# Altium schematic sheet 03_MCU.SchDoc
size A4
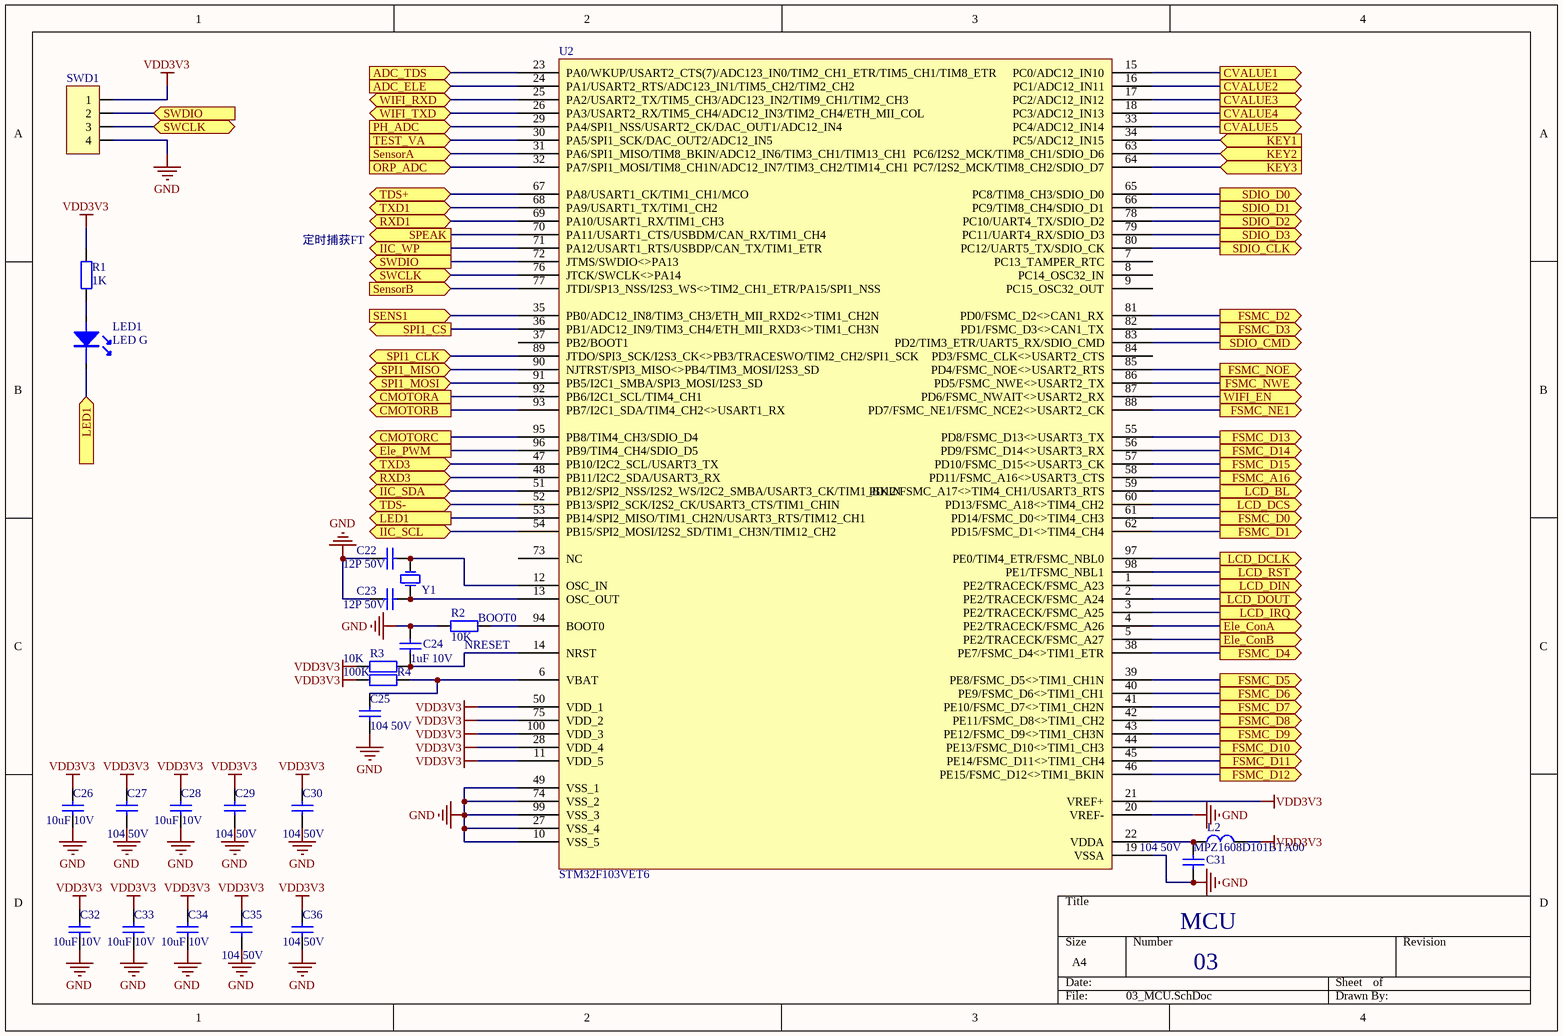
[diagram p0: 03_MCU.SchDoc]

## Parts
C22  12P 50V  [SMD-0603C]
C23  12P 50V  [SMD-0603C]
C24  1uF 10V  [SMD-0603C]
C25  104 50V  [SMD-0603C]
C26  10uF 10V  [SMD-0603C]
C27  104 50V  [SMD-0603C]
C28  10uF 10V  [SMD-0603C]
C29  104 50V  [SMD-0603C]
C30  104 50V  [SMD-0603C]
C31  104 50V  [SMD-0603C]
C32  10uF 10V  [SMD-0603C]
C33  10uF 10V  [SMD-0603C]
C34  10uF 10V  [SMD-0603C]
C35  104 50V  [SMD-0603C]
C36  104 50V  [SMD-0603C]
L2  MPZ1608D101BTA00  [SMD-0603]
LED1  LED G  [SMD-0603D]
R1  1K  [SMD-0603]
R2  10K  [SMD-0603]
R3  10K  [SMD-0603]
R4  100K  [SMD-0603]
SWD1  SIP-4 (NC)  [SIP-4]  (value not drawn)
U2  STM32F103VET6  [LQFP-100_14X14X05P]
Y1  8MHz  [XTAL-3225-2]  (value not drawn)

## Ports
ADC_ELE (in), ADC_TDS (in), CMOTORA (out), CMOTORB (out), CMOTORC (out), CVALUE1 (out), CVALUE2 (out), CVALUE3 (out), CVALUE4 (out), CVALUE5 (out), Ele_ConA (out), Ele_ConB (out), Ele_PWM (out), FSMC_A16 (out), FSMC_D0 (out), FSMC_D1 (out), FSMC_D2 (out), FSMC_D3 (out), FSMC_D4 (out), FSMC_D5 (out), FSMC_D6 (out), FSMC_D7 (out), FSMC_D8 (out), FSMC_D9 (out), FSMC_D10 (out), FSMC_D11 (out), FSMC_D12 (out), FSMC_D13 (out), FSMC_D14 (out), FSMC_D15 (out), FSMC_NE1 (out), FSMC_NOE (out), FSMC_NWE (out), IIC_SCL (bidir), IIC_SDA (bidir), IIC_WP (out), KEY1 (in), KEY2 (in), KEY3 (in), LCD_BL (out), LCD_DCLK (out), LCD_DCS (out), LCD_DIN (out), LCD_DOUT (out), LCD_IRQ (out), LCD_RST (out), LED1 (in), LED1 (out), ORP_ADC (in), PH_ADC (in), RXD1 (bidir), RXD3 (bidir), SDIO_CLK (out), SDIO_CMD (out), SDIO_D0 (out), SDIO_D1 (out), SDIO_D2 (out), SDIO_D3 (out), SENS1 (in), SensorA (in), SensorB (in), SPEAK (out), SPI1_CLK (bidir), SPI1_CS (out), SPI1_MISO (bidir), SPI1_MOSI (bidir), SWCLK, SWCLK (bidir), SWDIO (in), SWDIO (out), TDS+ (bidir), TDS- (bidir), TEST_VA (in), TXD1 (bidir), TXD3 (bidir), WIFI_EN (out), WIFI_RXD (bidir), WIFI_TXD (bidir)

## Nets
GND: C22.2 C23.2 C24.1 C25.1 C26.1 C27.1 C28.1 C29.1 C30.1 C31.1 C32.1 C33.1 C34.1 C35.1 C36.1 R2.2 SWD1.4 U2.10(VSS_5) U2.19(VSSA) U2.20(VREF-) U2.27(VSS_4) U2.49(VSS_1) U2.74(VSS_2) U2.99(VSS_3)
VDD3V3: C26.2 C27.2 C28.2 C29.2 C30.2 C32.2 C33.2 C34.2 C35.2 C36.2 L2.1 R1.2 R3.2 R4.2 SWD1.1 U2.11(VDD_5) U2.21(VREF+) U2.28(VDD_4) U2.50(VDD_1) U2.75(VDD_2) U2.100(VDD_3)
ADC_ELE: U2.24(PA1/USART2_RTS/ADC123_IN1/TIM5_CH2/TIM2_CH2) ; port ADC_ELE
ADC_TDS: U2.23(PA0/WKUP/USART2_CTS(7)/ADC123_IN0/TIM2_CH1_ETR/TIM5_CH1/TIM8_ETR) ; port ADC_TDS
CMOTORA: U2.92(PB6/I2C1_SCL/TIM4_CH1) ; port CMOTORA
CMOTORB: U2.93(PB7/I2C1_SDA/TIM4_CH2<>USART1_RX) ; port CMOTORB
CMOTORC: U2.95(PB8/TIM4_CH3/SDIO_D4) ; port CMOTORC
CVALUE1: U2.15(PC0/ADC12_IN10) ; port CVALUE1
CVALUE2: U2.16(PC1/ADC12_IN11) ; port CVALUE2
CVALUE3: U2.17(PC2/ADC12_IN12) ; port CVALUE3
CVALUE4: U2.18(PC3/ADC12_IN13) ; port CVALUE4
CVALUE5: U2.33(PC4/ADC12_IN14) ; port CVALUE5
Ele_ConA: U2.4(PE2/TRACECK/FSMC_A26) ; port Ele_ConA
Ele_ConB: U2.5(PE2/TRACECK/FSMC_A27) ; port Ele_ConB
Ele_PWM: U2.96(PB9/TIM4_CH4/SDIO_D5) ; port Ele_PWM
FSMC_A16: U2.58(PD11/FSMC_A16<>USART3_CTS) ; port FSMC_A16
FSMC_D0: U2.61(PD14/FSMC_D0<>TIM4_CH3) ; port FSMC_D0
FSMC_D1: U2.62(PD15/FSMC_D1<>TIM4_CH4) ; port FSMC_D1
FSMC_D2: U2.81(PD0/FSMC_D2<>CAN1_RX) ; port FSMC_D2
FSMC_D3: U2.82(PD1/FSMC_D3<>CAN1_TX) ; port FSMC_D3
FSMC_D4: U2.38(PE7/FSMC_D4<>TIM1_ETR) ; port FSMC_D4
FSMC_D5: U2.39(PE8/FSMC_D5<>TIM1_CH1N) ; port FSMC_D5
FSMC_D6: U2.40(PE9/FSMC_D6<>TIM1_CH1) ; port FSMC_D6
FSMC_D7: U2.41(PE10/FSMC_D7<>TIM1_CH2N) ; port FSMC_D7
FSMC_D8: U2.42(PE11/FSMC_D8<>TIM1_CH2) ; port FSMC_D8
FSMC_D9: U2.43(PE12/FSMC_D9<>TIM1_CH3N) ; port FSMC_D9
FSMC_D10: U2.44(PE13/FSMC_D10<>TIM1_CH3) ; port FSMC_D10
FSMC_D11: U2.45(PE14/FSMC_D11<>TIM1_CH4) ; port FSMC_D11
FSMC_D12: U2.46(PE15/FSMC_D12<>TIM1_BKIN) ; port FSMC_D12
FSMC_D13: U2.55(PD8/FSMC_D13<>USART3_TX) ; port FSMC_D13
FSMC_D14: U2.56(PD9/FSMC_D14<>USART3_RX) ; port FSMC_D14
FSMC_D15: U2.57(PD10/FSMC_D15<>USART3_CK) ; port FSMC_D15
FSMC_NE1: U2.88(PD7/FSMC_NE1/FSMC_NCE2<>USART2_CK) ; port FSMC_NE1
FSMC_NOE: U2.85(PD4/FSMC_NOE<>USART2_RTS) ; port FSMC_NOE
FSMC_NWE: U2.86(PD5/FSMC_NWE<>USART2_TX) ; port FSMC_NWE
IIC_SCL: U2.54(PB15/SPI2_MOSI/I2S2_SD/TIM1_CH3N/TIM12_CH2) ; port IIC_SCL
IIC_SDA: U2.51(PB12/SPI2_NSS/I2S2_WS/I2C2_SMBA/USART3_CK/TIM1_BKIN) ; port IIC_SDA
IIC_WP: U2.71(PA12/USART1_RTS/USBDP/CAN_TX/TIM1_ETR) ; port IIC_WP
KEY1: U2.34(PC5/ADC12_IN15) ; port KEY1
KEY2: U2.63(PC6/I2S2_MCK/TIM8_CH1/SDIO_D6) ; port KEY2
KEY3: U2.64(PC7/I2S2_MCK/TIM8_CH2/SDIO_D7) ; port KEY3
LCD_BL: U2.59(PD12/FSMC_A17<>TIM4_CH1/USART3_RTS) ; port LCD_BL
LCD_DCLK: U2.97(PE0/TIM4_ETR/FSMC_NBL0) ; port LCD_DCLK
LCD_DCS: U2.60(PD13/FSMC_A18<>TIM4_CH2) ; port LCD_DCS
LCD_DIN: U2.1(PE2/TRACECK/FSMC_A23) ; port LCD_DIN
LCD_DOUT: U2.2(PE2/TRACECK/FSMC_A24) ; port LCD_DOUT
LCD_IRQ: U2.3(PE2/TRACECK/FSMC_A25) ; port LCD_IRQ
LCD_RST: U2.98(PE1/TFSMC_NBL1) ; port LCD_RST
LED1: LED1.2(K) U2.53(PB14/SPI2_MISO/TIM1_CH2N/USART3_RTS/TIM12_CH1) ; port LED1
ORP_ADC: U2.32(PA7/SPI1_MOSI/TIM8_CH1N/ADC12_IN7/TIM3_CH2/TIM14_CH1) ; port ORP_ADC
PH_ADC: U2.29(PA4/SPI1_NSS/USART2_CK/DAC_OUT1/ADC12_IN4) ; port PH_ADC
RXD1: U2.69(PA10/USART1_RX/TIM1_CH3) ; port RXD1
RXD3: U2.48(PB11/I2C2_SDA/USART3_RX) ; port RXD3
SDIO_CLK: U2.80(PC12/UART5_TX/SDIO_CK) ; port SDIO_CLK
SDIO_CMD: U2.83(PD2/TIM3_ETR/UART5_RX/SDIO_CMD) ; port SDIO_CMD
SDIO_D0: U2.65(PC8/TIM8_CH3/SDIO_D0) ; port SDIO_D0
SDIO_D1: U2.66(PC9/TIM8_CH4/SDIO_D1) ; port SDIO_D1
SDIO_D2: U2.78(PC10/UART4_TX/SDIO_D2) ; port SDIO_D2
SDIO_D3: U2.79(PC11/UART4_RX/SDIO_D3) ; port SDIO_D3
SENS1: U2.35(PB0/ADC12_IN8/TIM3_CH3/ETH_MII_RXD2<>TIM1_CH2N) ; port SENS1
SensorA: U2.31(PA6/SPI1_MISO/TIM8_BKIN/ADC12_IN6/TIM3_CH1/TIM13_CH1) ; port SensorA
SensorB: U2.77(JTDI/SP13_NSS/I2S3_WS<>TIM2_CH1_ETR/PA15/SPI1_NSS) ; port SensorB
SPEAK: U2.70(PA11/USART1_CTS/USBDM/CAN_RX/TIM1_CH4) ; port SPEAK
SPI1_CLK: U2.89(JTDO/SPI3_SCK/I2S3_CK<>PB3/TRACESWO/TIM2_CH2/SPI1_SCK) ; port SPI1_CLK
SPI1_CS: U2.36(PB1/ADC12_IN9/TIM3_CH4/ETH_MII_RXD3<>TIM1_CH3N) ; port SPI1_CS
SPI1_MISO: U2.90(NJTRST/SPI3_MISO<>PB4/TIM3_MOSI/I2S3_SD) ; port SPI1_MISO
SPI1_MOSI: U2.91(PB5/I2C1_SMBA/SPI3_MOSI/I2S3_SD) ; port SPI1_MOSI
SWCLK: SWD1.3 U2.76(JTCK/SWCLK<>PA14) ; port SWCLK
SWDIO: SWD1.2 U2.72(JTMS/SWDIO<>PA13) ; port SWDIO
TDS+: U2.67(PA8/USART1_CK/TIM1_CH1/MCO) ; port TDS+
TDS-: U2.52(PB13/SPI2_SCK/I2S2_CK/USART3_CTS/TIM1_CHIN) ; port TDS-
TEST_VA: U2.30(PA5/SPI1_SCK/DAC_OUT2/ADC12_IN5) ; port TEST_VA
TXD1: U2.68(PA9/USART1_TX/TIM1_CH2) ; port TXD1
TXD3: U2.47(PB10/I2C2_SCL/USART3_TX) ; port TXD3
WIFI_EN: U2.87(PD6/FSMC_NWAIT<>USART2_RX) ; port WIFI_EN
WIFI_RXD: U2.25(PA2/USART2_TX/TIM5_CH3/ADC123_IN2/TIM9_CH1/TIM2_CH3) ; port WIFI_RXD
WIFI_TXD: U2.26(PA3/USART2_RX/TIM5_CH4/ADC12_IN3/TIM2_CH4/ETH_MII_COL) ; port WIFI_TXD
NetC22_1: C22.1 U2.12(OSC_IN) Y1.2(OSC2)
NetC23_1: C23.1 U2.13(OSC_OUT) Y1.1(OSC1)
NetC24_2: C24.2 R3.1 U2.14(NRST)
NetC25_2: C25.2 R4.1 U2.6(VBAT)
NetC31_2: C31.2 L2.2 U2.22(VDDA)
NetLED1_1: LED1.1(A) R1.1
NetR2_1: R2.1 U2.94(BOOT0)

Not connected (* = marked no-connect by the designer): U2 7(PC13_TAMPER_RTC) 8(PC14_OSC32_IN) 9(PC15_OSC32_OUT) 37(PB2/BOOT1) 73(NC) 84(PD3/FSMC_CLK<>USART2_CTS)

## Notes on the sheet
- 定时捕获FT
- (near R2) NRESET
- (near R2) BOOT0
- (near C31) MCU
- 03

## Library data of the parts
C22 C23 = CAP4: 贴片电容 5%
C24-C36 = CAP4: 贴片电容 20%
L2 = CIZHU1: 磁珠电感 100R 100MHz
LED1 = LED: 绿色普亮
R1 = RES0: 贴片电阻 5%
R2-R4 = RES2: 贴片电阻 5%
SWD1 = SIP-4: ISP 下载
Y1 = XTAL: 3225 贴片晶振